# Altium schematic sheet rs232.SchDoc
size A4
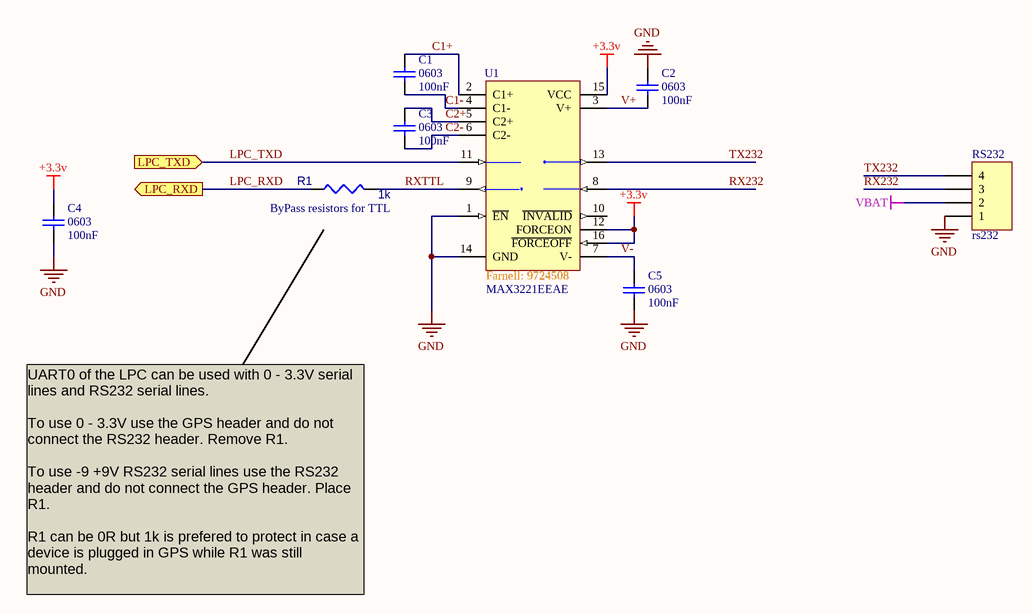
[diagram p0: rs232.SchDoc]

## Parts
C1  0603  value 100nF  [0603]
C2  0603  value 100nF  [0603]
C3  0603  value 100nF  [0603]
C4  0603  value 100nF  [0603]
C5  0603  value 100nF  [0603]
R1  1k  [0603RES]
RS232  rs232  [HDR4]
U1  MAX3221EEAE  Farnell: 9724508  [SSOP16]

## Ports
LPC_RXD (out), LPC_TXD (in)

## Nets
+3.3v: C4.2 U1.12(FORCEON) U1.15(VCC) U1.16(~{FORCEOFF})
GND: C2.2 C4.1 C5.1 RS232.1 U1.1(~{EN}) U1.14(GND)
VBAT: RS232.2
C1+: C1.2 U1.2(C1+)
C1-: C1.1 U1.4(C1-)
C2+: C3.2 U1.5(C2+)
C2-: C3.1 U1.6(C2-)
LPC_RXD: R1.1 ; port LPC_RXD
LPC_TXD: U1.11(T1IN) ; port LPC_TXD
RX232: RS232.3 U1.8(R1IN)
RXTTL: R1.2 U1.9(R1OUT)
TX232: RS232.4 U1.13(T1OUT)
V+: C2.1 U1.3(V+)
V-: C5.2 U1.7(V-)

Not connected (* = marked no-connect by the designer): U1 10(~{INVALID})

## Notes on the sheet
- (near R1) ByPass resistors for TTL
- UART0 of the LPC can be used with 0 - 3.3V serial lines and RS232 serial lines.
  To use 0 - 3.3V use the GPS header and do not connect the RS232 header. Remove R1.
  To use -9 +9V RS232 serial lines use the RS232 header and do not connect the GPS header. Place R1.
  R1 can be 0R but 1k is prefered to protect in case a device is plugged in GPS while R1 was still mounted.

## Library data of the parts
C1-C3 C5 = Cap: Capacitor; Published: 8-Jun-2000; LatestRevisionDate: 17-Jul-2002; LatestRevisionNote: Re-released for DXP Platform.; PackageReference: RAD-0.3; Publisher: Altium Limited
C4 = Cap: Capacitor; Voltage: 50V; Rating: X7R; id: 68; Type: Ceramic; Published: 8-Jun-2000; LatestRevisionDate: 17-Jul-2002; LatestRevisionNote: Re-released for DXP Platform.; PackageReference: RAD-0.3; Publisher: Altium Limited; Footprint Ref: 0603; Library Ref: Cap; Price: 0.0145; DigiKey: 709-1161-1-ND
R1 = RES1
RS232 = Header 4: Header, 4-Pin; LatestRevisionDate: 17-Jul-2002; LatestRevisionNote: Re-released for DXP Platform.; Publisher: Altium Limited
U1 = MAX3221EEAE: ±15kV ESD-Protected, 1µA, 3.0V/5.5V, 250kbps, RS-232 Transceiver with AutoShutdown; Published: 16-Jan-2001; LatestRevisionDate: 06-Jun-2005; LatestRevisionNote: Stylized 3D Model Added.; DatasheetVersion: Jan-1998; PackageVersion: 1996; PackageReference: SSOP16; Publisher: Altium Limited; PackageDescription: SSOP; 16 Leads; Body Width 5.3 mm; Pitch 0.65 mm; ComponentLink1Description: Manufacturer Link; ComponentLink1URL: http://www.maxim-ic.com/; ComponentLink2Description: Datasheet; ComponentLink2URL: http://pdfserv.maxim-ic.com/en/ds/MAX3221E-MAX3243E.pdf